# EAGLE design borg16disp (EAGLE 4.16)
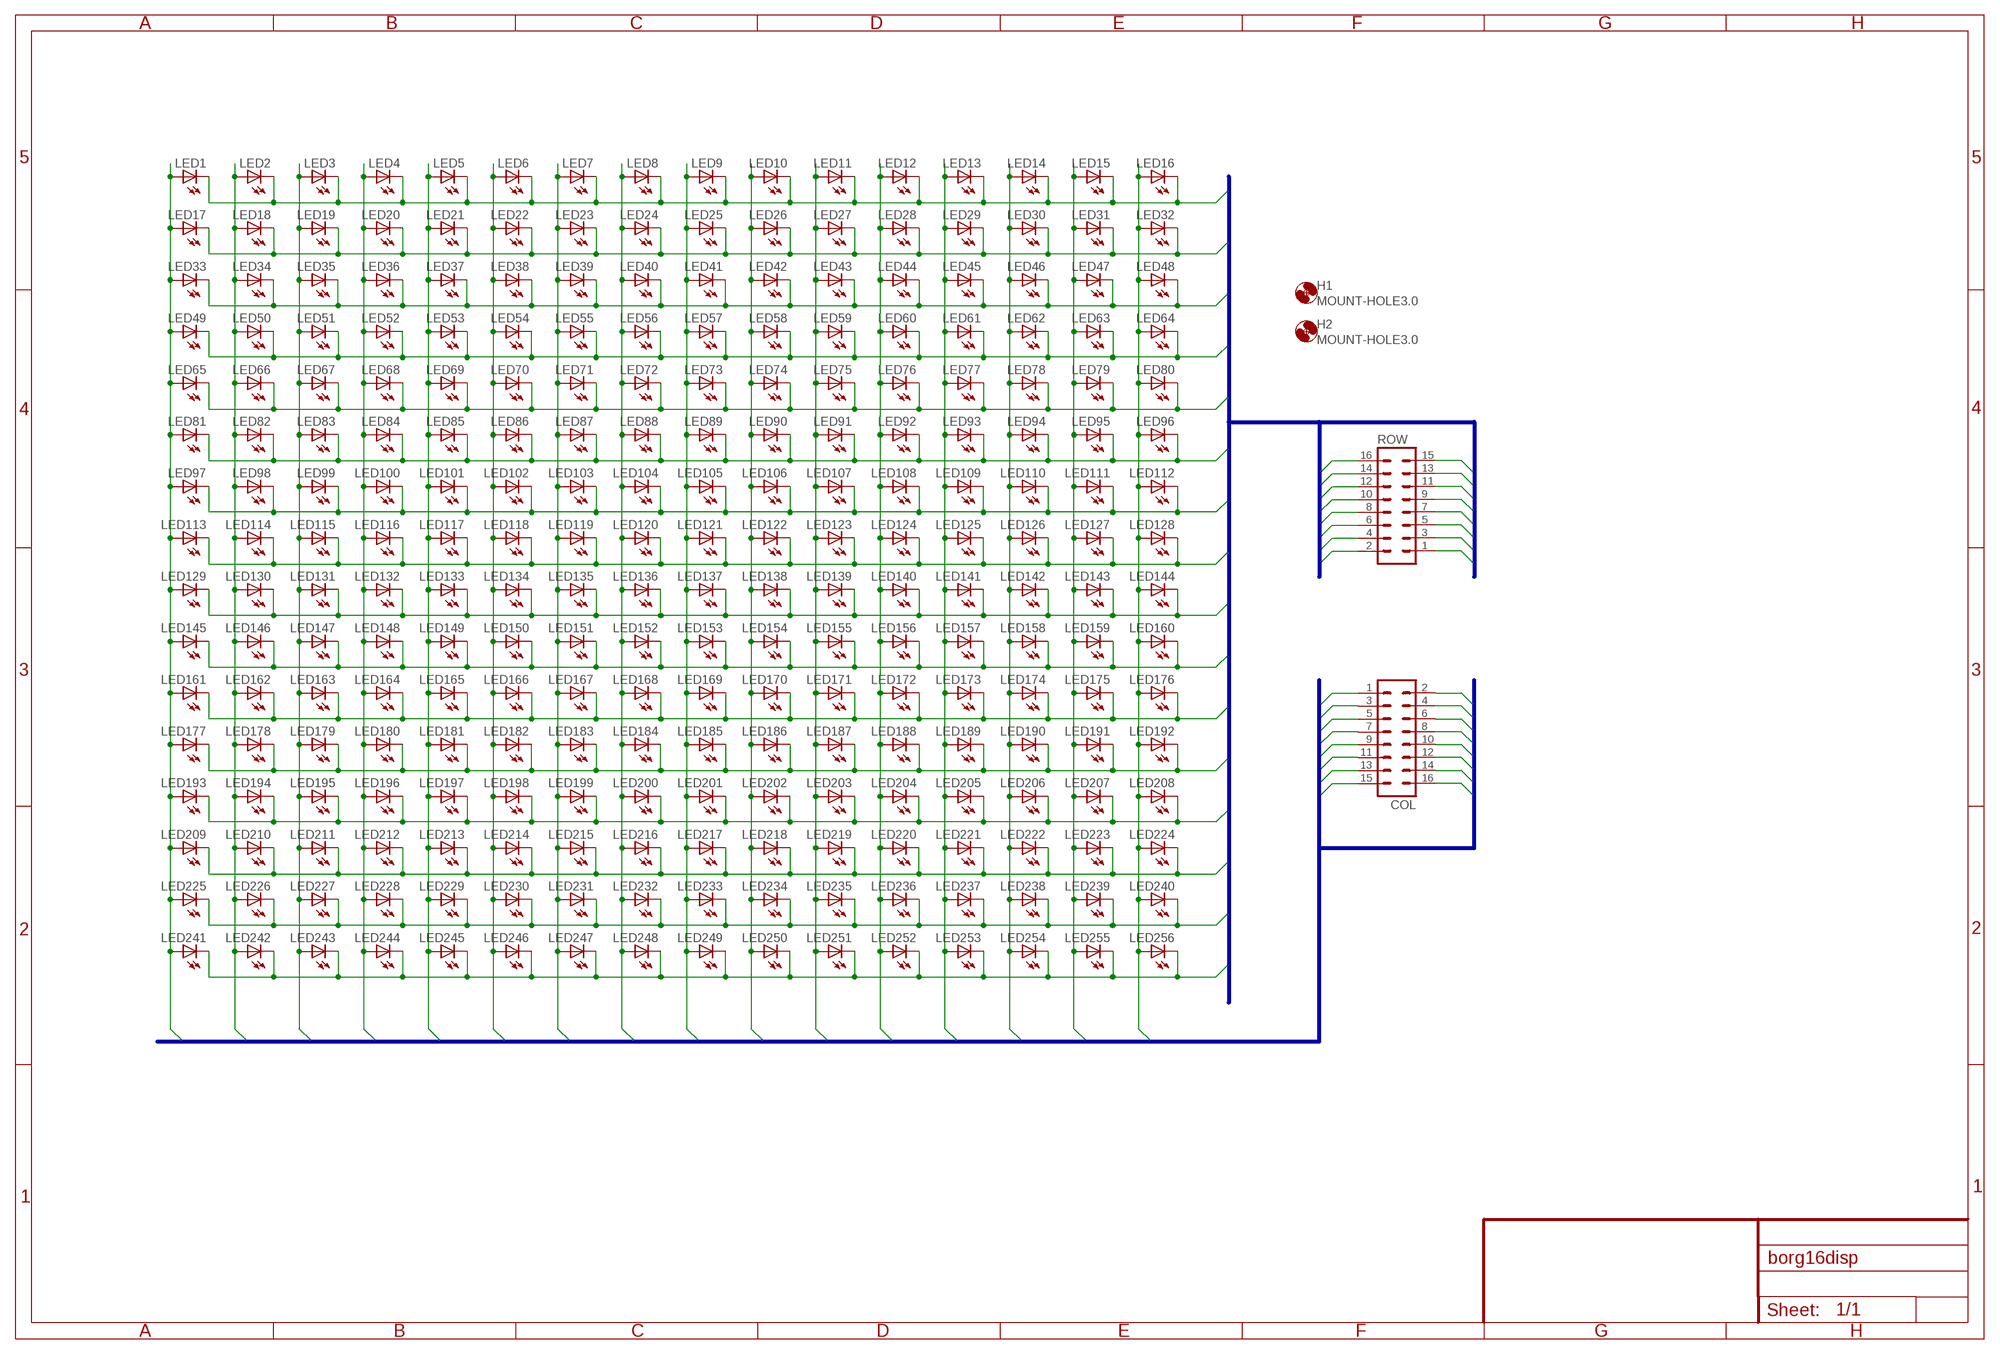
[diagram p0: schematic, sheet 1]

## Parts
COL  ML16  [ML16]
H1  MOUNT-HOLE3.0  [3,0]
H2  MOUNT-HOLE3.0  [3,0]
LED1  LED3MM  [LED3MM]
LED2  LED3MM  [LED3MM]
LED3  LED3MM  [LED3MM]
LED4  LED3MM  [LED3MM]
LED5  LED3MM  [LED3MM]
LED6  LED3MM  [LED3MM]
LED7  LED3MM  [LED3MM]
LED8  LED3MM  [LED3MM]
LED9  LED3MM  [LED3MM]
LED10  LED3MM  [LED3MM]
LED11  LED3MM  [LED3MM]
LED12  LED3MM  [LED3MM]
LED13  LED3MM  [LED3MM]
LED14  LED3MM  [LED3MM]
LED15  LED3MM  [LED3MM]
LED16  LED3MM  [LED3MM]
LED17  LED3MM  [LED3MM]
LED18  LED3MM  [LED3MM]
LED19  LED3MM  [LED3MM]
LED20  LED3MM  [LED3MM]
LED21  LED3MM  [LED3MM]
LED22  LED3MM  [LED3MM]
LED23  LED3MM  [LED3MM]
LED24  LED3MM  [LED3MM]
LED25  LED3MM  [LED3MM]
LED26  LED3MM  [LED3MM]
LED27  LED3MM  [LED3MM]
LED28  LED3MM  [LED3MM]
LED29  LED3MM  [LED3MM]
LED30  LED3MM  [LED3MM]
LED31  LED3MM  [LED3MM]
LED32  LED3MM  [LED3MM]
LED33  LED3MM  [LED3MM]
LED34  LED3MM  [LED3MM]
LED35  LED3MM  [LED3MM]
LED36  LED3MM  [LED3MM]
LED37  LED3MM  [LED3MM]
LED38  LED3MM  [LED3MM]
LED39  LED3MM  [LED3MM]
LED40  LED3MM  [LED3MM]
LED41  LED3MM  [LED3MM]
LED42  LED3MM  [LED3MM]
LED43  LED3MM  [LED3MM]
LED44  LED3MM  [LED3MM]
LED45  LED3MM  [LED3MM]
LED46  LED3MM  [LED3MM]
LED47  LED3MM  [LED3MM]
LED48  LED3MM  [LED3MM]
LED49  LED3MM  [LED3MM]
LED50  LED3MM  [LED3MM]
LED51  LED3MM  [LED3MM]
LED52  LED3MM  [LED3MM]
LED53  LED3MM  [LED3MM]
LED54  LED3MM  [LED3MM]
LED55  LED3MM  [LED3MM]
LED56  LED3MM  [LED3MM]
LED57  LED3MM  [LED3MM]
LED58  LED3MM  [LED3MM]
LED59  LED3MM  [LED3MM]
LED60  LED3MM  [LED3MM]
LED61  LED3MM  [LED3MM]
LED62  LED3MM  [LED3MM]
LED63  LED3MM  [LED3MM]
LED64  LED3MM  [LED3MM]
LED65  LED3MM  [LED3MM]
LED66  LED3MM  [LED3MM]
LED67  LED3MM  [LED3MM]
LED68  LED3MM  [LED3MM]
LED69  LED3MM  [LED3MM]
LED70  LED3MM  [LED3MM]
LED71  LED3MM  [LED3MM]
LED72  LED3MM  [LED3MM]
LED73  LED3MM  [LED3MM]
LED74  LED3MM  [LED3MM]
LED75  LED3MM  [LED3MM]
LED76  LED3MM  [LED3MM]
LED77  LED3MM  [LED3MM]
LED78  LED3MM  [LED3MM]
LED79  LED3MM  [LED3MM]
LED80  LED3MM  [LED3MM]
LED81  LED3MM  [LED3MM]
LED82  LED3MM  [LED3MM]
LED83  LED3MM  [LED3MM]
LED84  LED3MM  [LED3MM]
LED85  LED3MM  [LED3MM]
LED86  LED3MM  [LED3MM]
LED87  LED3MM  [LED3MM]
LED88  LED3MM  [LED3MM]
LED89  LED3MM  [LED3MM]
LED90  LED3MM  [LED3MM]
LED91  LED3MM  [LED3MM]
LED92  LED3MM  [LED3MM]
LED93  LED3MM  [LED3MM]
LED94  LED3MM  [LED3MM]
LED95  LED3MM  [LED3MM]
LED96  LED3MM  [LED3MM]
LED97  LED3MM  [LED3MM]
LED98  LED3MM  [LED3MM]
LED99  LED3MM  [LED3MM]
LED100  LED3MM  [LED3MM]
LED101  LED3MM  [LED3MM]
LED102  LED3MM  [LED3MM]
LED103  LED3MM  [LED3MM]
LED104  LED3MM  [LED3MM]
LED105  LED3MM  [LED3MM]
LED106  LED3MM  [LED3MM]
LED107  LED3MM  [LED3MM]
LED108  LED3MM  [LED3MM]
LED109  LED3MM  [LED3MM]
LED110  LED3MM  [LED3MM]
LED111  LED3MM  [LED3MM]
LED112  LED3MM  [LED3MM]
LED113  LED3MM  [LED3MM]
LED114  LED3MM  [LED3MM]
LED115  LED3MM  [LED3MM]
LED116  LED3MM  [LED3MM]
LED117  LED3MM  [LED3MM]
LED118  LED3MM  [LED3MM]
LED119  LED3MM  [LED3MM]
LED120  LED3MM  [LED3MM]
LED121  LED3MM  [LED3MM]
LED122  LED3MM  [LED3MM]
LED123  LED3MM  [LED3MM]
LED124  LED3MM  [LED3MM]
LED125  LED3MM  [LED3MM]
LED126  LED3MM  [LED3MM]
LED127  LED3MM  [LED3MM]
LED128  LED3MM  [LED3MM]
LED129  LED3MM  [LED3MM]
LED130  LED3MM  [LED3MM]
LED131  LED3MM  [LED3MM]
LED132  LED3MM  [LED3MM]
LED133  LED3MM  [LED3MM]
LED134  LED3MM  [LED3MM]
LED135  LED3MM  [LED3MM]
LED136  LED3MM  [LED3MM]
LED137  LED3MM  [LED3MM]
LED138  LED3MM  [LED3MM]
LED139  LED3MM  [LED3MM]
LED140  LED3MM  [LED3MM]
LED141  LED3MM  [LED3MM]
LED142  LED3MM  [LED3MM]
LED143  LED3MM  [LED3MM]
LED144  LED3MM  [LED3MM]
LED145  LED3MM  [LED3MM]
LED146  LED3MM  [LED3MM]
LED147  LED3MM  [LED3MM]
LED148  LED3MM  [LED3MM]
LED149  LED3MM  [LED3MM]
LED150  LED3MM  [LED3MM]
LED151  LED3MM  [LED3MM]
LED152  LED3MM  [LED3MM]
LED153  LED3MM  [LED3MM]
LED154  LED3MM  [LED3MM]
LED155  LED3MM  [LED3MM]
LED156  LED3MM  [LED3MM]
LED157  LED3MM  [LED3MM]
LED158  LED3MM  [LED3MM]
LED159  LED3MM  [LED3MM]
LED160  LED3MM  [LED3MM]
LED161  LED3MM  [LED3MM]
LED162  LED3MM  [LED3MM]
LED163  LED3MM  [LED3MM]
LED164  LED3MM  [LED3MM]
LED165  LED3MM  [LED3MM]
LED166  LED3MM  [LED3MM]
LED167  LED3MM  [LED3MM]
LED168  LED3MM  [LED3MM]
LED169  LED3MM  [LED3MM]
LED170  LED3MM  [LED3MM]
LED171  LED3MM  [LED3MM]
LED172  LED3MM  [LED3MM]
LED173  LED3MM  [LED3MM]
LED174  LED3MM  [LED3MM]
LED175  LED3MM  [LED3MM]
LED176  LED3MM  [LED3MM]
LED177  LED3MM  [LED3MM]
LED178  LED3MM  [LED3MM]
LED179  LED3MM  [LED3MM]
LED180  LED3MM  [LED3MM]
LED181  LED3MM  [LED3MM]
LED182  LED3MM  [LED3MM]
LED183  LED3MM  [LED3MM]
LED184  LED3MM  [LED3MM]
LED185  LED3MM  [LED3MM]
LED186  LED3MM  [LED3MM]
LED187  LED3MM  [LED3MM]
LED188  LED3MM  [LED3MM]
LED189  LED3MM  [LED3MM]
LED190  LED3MM  [LED3MM]
LED191  LED3MM  [LED3MM]
LED192  LED3MM  [LED3MM]
LED193  LED3MM  [LED3MM]
LED194  LED3MM  [LED3MM]
LED195  LED3MM  [LED3MM]
LED196  LED3MM  [LED3MM]
LED197  LED3MM  [LED3MM]
LED198  LED3MM  [LED3MM]
LED199  LED3MM  [LED3MM]
LED200  LED3MM  [LED3MM]
LED201  LED3MM  [LED3MM]
LED202  LED3MM  [LED3MM]
LED203  LED3MM  [LED3MM]
LED204  LED3MM  [LED3MM]
LED205  LED3MM  [LED3MM]
LED206  LED3MM  [LED3MM]
LED207  LED3MM  [LED3MM]
LED208  LED3MM  [LED3MM]
LED209  LED3MM  [LED3MM]
LED210  LED3MM  [LED3MM]
LED211  LED3MM  [LED3MM]
LED212  LED3MM  [LED3MM]
LED213  LED3MM  [LED3MM]
LED214  LED3MM  [LED3MM]
LED215  LED3MM  [LED3MM]
LED216  LED3MM  [LED3MM]
LED217  LED3MM  [LED3MM]
LED218  LED3MM  [LED3MM]
LED219  LED3MM  [LED3MM]
LED220  LED3MM  [LED3MM]
LED221  LED3MM  [LED3MM]
LED222  LED3MM  [LED3MM]
LED223  LED3MM  [LED3MM]
LED224  LED3MM  [LED3MM]
LED225  LED3MM  [LED3MM]
LED226  LED3MM  [LED3MM]
LED227  LED3MM  [LED3MM]
LED228  LED3MM  [LED3MM]
LED229  LED3MM  [LED3MM]
LED230  LED3MM  [LED3MM]
LED231  LED3MM  [LED3MM]
LED232  LED3MM  [LED3MM]
LED233  LED3MM  [LED3MM]
LED234  LED3MM  [LED3MM]
LED235  LED3MM  [LED3MM]
LED236  LED3MM  [LED3MM]
LED237  LED3MM  [LED3MM]
LED238  LED3MM  [LED3MM]
LED239  LED3MM  [LED3MM]
LED240  LED3MM  [LED3MM]
LED241  LED3MM  [LED3MM]
LED242  LED3MM  [LED3MM]
LED243  LED3MM  [LED3MM]
LED244  LED3MM  [LED3MM]
LED245  LED3MM  [LED3MM]
LED246  LED3MM  [LED3MM]
LED247  LED3MM  [LED3MM]
LED248  LED3MM  [LED3MM]
LED249  LED3MM  [LED3MM]
LED250  LED3MM  [LED3MM]
LED251  LED3MM  [LED3MM]
LED252  LED3MM  [LED3MM]
LED253  LED3MM  [LED3MM]
LED254  LED3MM  [LED3MM]
LED255  LED3MM  [LED3MM]
LED256  LED3MM  [LED3MM]
ROW  ML16  [ML16]

## Nets
COL1: COL.16 LED1.A LED17.A LED33.A LED49.A LED65.A LED81.A LED97.A LED113.A LED129.A LED145.A LED161.A LED177.A LED193.A LED209.A LED225.A LED241.A
COL2: COL.15 LED2.A LED18.A LED34.A LED50.A LED66.A LED82.A LED98.A LED114.A LED130.A LED146.A LED162.A LED178.A LED194.A LED210.A LED226.A LED242.A
COL3: COL.14 LED3.A LED19.A LED35.A LED51.A LED67.A LED83.A LED99.A LED115.A LED131.A LED147.A LED163.A LED179.A LED195.A LED211.A LED227.A LED243.A
COL4: COL.13 LED4.A LED20.A LED36.A LED52.A LED68.A LED84.A LED100.A LED116.A LED132.A LED148.A LED164.A LED180.A LED196.A LED212.A LED228.A LED244.A
COL5: COL.12 LED5.A LED21.A LED37.A LED53.A LED69.A LED85.A LED101.A LED117.A LED133.A LED149.A LED165.A LED181.A LED197.A LED213.A LED229.A LED245.A
COL6: COL.11 LED6.A LED22.A LED38.A LED54.A LED70.A LED86.A LED102.A LED118.A LED134.A LED150.A LED166.A LED182.A LED198.A LED214.A LED230.A LED246.A
COL7: COL.10 LED7.A LED23.A LED39.A LED55.A LED71.A LED87.A LED103.A LED119.A LED135.A LED151.A LED167.A LED183.A LED199.A LED215.A LED231.A LED247.A
COL8: COL.9 LED8.A LED24.A LED40.A LED56.A LED72.A LED88.A LED104.A LED120.A LED136.A LED152.A LED168.A LED184.A LED200.A LED216.A LED232.A LED248.A
COL9: COL.8 LED9.A LED25.A LED41.A LED57.A LED73.A LED89.A LED105.A LED121.A LED137.A LED153.A LED169.A LED185.A LED201.A LED217.A LED233.A LED249.A
COL10: COL.7 LED10.A LED26.A LED42.A LED58.A LED74.A LED90.A LED106.A LED122.A LED138.A LED154.A LED170.A LED186.A LED202.A LED218.A LED234.A LED250.A
COL11: COL.6 LED11.A LED27.A LED43.A LED59.A LED75.A LED91.A LED107.A LED123.A LED139.A LED155.A LED171.A LED187.A LED203.A LED219.A LED235.A LED251.A
COL12: COL.5 LED12.A LED28.A LED44.A LED60.A LED76.A LED92.A LED108.A LED124.A LED140.A LED156.A LED172.A LED188.A LED204.A LED220.A LED236.A LED252.A
COL13: COL.4 LED13.A LED29.A LED45.A LED61.A LED77.A LED93.A LED109.A LED125.A LED141.A LED157.A LED173.A LED189.A LED205.A LED221.A LED237.A LED253.A
COL14: COL.3 LED14.A LED30.A LED46.A LED62.A LED78.A LED94.A LED110.A LED126.A LED142.A LED158.A LED174.A LED190.A LED206.A LED222.A LED238.A LED254.A
COL15: COL.2 LED15.A LED31.A LED47.A LED63.A LED79.A LED95.A LED111.A LED127.A LED143.A LED159.A LED175.A LED191.A LED207.A LED223.A LED239.A LED255.A
COL16: COL.1 LED16.A LED32.A LED48.A LED64.A LED80.A LED96.A LED112.A LED128.A LED144.A LED160.A LED176.A LED192.A LED208.A LED224.A LED240.A LED256.A
ROW1: LED1.K(C) LED2.K(C) LED3.K(C) LED4.K(C) LED5.K(C) LED6.K(C) LED7.K(C) LED8.K(C) LED9.K(C) LED10.K(C) LED11.K(C) LED12.K(C) LED13.K(C) LED14.K(C) LED15.K(C) LED16.K(C) ROW.1
ROW2: LED17.K(C) LED18.K(C) LED19.K(C) LED20.K(C) LED21.K(C) LED22.K(C) LED23.K(C) LED24.K(C) LED25.K(C) LED26.K(C) LED27.K(C) LED28.K(C) LED29.K(C) LED30.K(C) LED31.K(C) LED32.K(C) ROW.2
ROW3: LED33.K(C) LED34.K(C) LED35.K(C) LED36.K(C) LED37.K(C) LED38.K(C) LED39.K(C) LED40.K(C) LED41.K(C) LED42.K(C) LED43.K(C) LED44.K(C) LED45.K(C) LED46.K(C) LED47.K(C) LED48.K(C) ROW.3
ROW4: LED49.K(C) LED50.K(C) LED51.K(C) LED52.K(C) LED53.K(C) LED54.K(C) LED55.K(C) LED56.K(C) LED57.K(C) LED58.K(C) LED59.K(C) LED60.K(C) LED61.K(C) LED62.K(C) LED63.K(C) LED64.K(C) ROW.4
ROW5: LED65.K(C) LED66.K(C) LED67.K(C) LED68.K(C) LED69.K(C) LED70.K(C) LED71.K(C) LED72.K(C) LED73.K(C) LED74.K(C) LED75.K(C) LED76.K(C) LED77.K(C) LED78.K(C) LED79.K(C) LED80.K(C) ROW.5
ROW6: LED81.K(C) LED82.K(C) LED83.K(C) LED84.K(C) LED85.K(C) LED86.K(C) LED87.K(C) LED88.K(C) LED89.K(C) LED90.K(C) LED91.K(C) LED92.K(C) LED93.K(C) LED94.K(C) LED95.K(C) LED96.K(C) ROW.6
ROW7: LED97.K(C) LED98.K(C) LED99.K(C) LED100.K(C) LED101.K(C) LED102.K(C) LED103.K(C) LED104.K(C) LED105.K(C) LED106.K(C) LED107.K(C) LED108.K(C) LED109.K(C) LED110.K(C) LED111.K(C) LED112.K(C) ROW.7
ROW8: LED113.K(C) LED114.K(C) LED115.K(C) LED116.K(C) LED117.K(C) LED118.K(C) LED119.K(C) LED120.K(C) LED121.K(C) LED122.K(C) LED123.K(C) LED124.K(C) LED125.K(C) LED126.K(C) LED127.K(C) LED128.K(C) ROW.8
ROW9: LED129.K(C) LED130.K(C) LED131.K(C) LED132.K(C) LED133.K(C) LED134.K(C) LED135.K(C) LED136.K(C) LED137.K(C) LED138.K(C) LED139.K(C) LED140.K(C) LED141.K(C) LED142.K(C) LED143.K(C) LED144.K(C) ROW.9
ROW10: LED145.K(C) LED146.K(C) LED147.K(C) LED148.K(C) LED149.K(C) LED150.K(C) LED151.K(C) LED152.K(C) LED153.K(C) LED154.K(C) LED155.K(C) LED156.K(C) LED157.K(C) LED158.K(C) LED159.K(C) LED160.K(C) ROW.10
ROW11: LED161.K(C) LED162.K(C) LED163.K(C) LED164.K(C) LED165.K(C) LED166.K(C) LED167.K(C) LED168.K(C) LED169.K(C) LED170.K(C) LED171.K(C) LED172.K(C) LED173.K(C) LED174.K(C) LED175.K(C) LED176.K(C) ROW.11
ROW12: LED177.K(C) LED178.K(C) LED179.K(C) LED180.K(C) LED181.K(C) LED182.K(C) LED183.K(C) LED184.K(C) LED185.K(C) LED186.K(C) LED187.K(C) LED188.K(C) LED189.K(C) LED190.K(C) LED191.K(C) LED192.K(C) ROW.12
ROW13: LED193.K(C) LED194.K(C) LED195.K(C) LED196.K(C) LED197.K(C) LED198.K(C) LED199.K(C) LED200.K(C) LED201.K(C) LED202.K(C) LED203.K(C) LED204.K(C) LED205.K(C) LED206.K(C) LED207.K(C) LED208.K(C) ROW.13
ROW14: LED209.K(C) LED210.K(C) LED211.K(C) LED212.K(C) LED213.K(C) LED214.K(C) LED215.K(C) LED216.K(C) LED217.K(C) LED218.K(C) LED219.K(C) LED220.K(C) LED221.K(C) LED222.K(C) LED223.K(C) LED224.K(C) ROW.14
ROW15: LED225.K(C) LED226.K(C) LED227.K(C) LED228.K(C) LED229.K(C) LED230.K(C) LED231.K(C) LED232.K(C) LED233.K(C) LED234.K(C) LED235.K(C) LED236.K(C) LED237.K(C) LED238.K(C) LED239.K(C) LED240.K(C) ROW.15
ROW16: LED241.K(C) LED242.K(C) LED243.K(C) LED244.K(C) LED245.K(C) LED246.K(C) LED247.K(C) LED248.K(C) LED249.K(C) LED250.K(C) LED251.K(C) LED252.K(C) LED253.K(C) LED254.K(C) LED255.K(C) LED256.K(C) ROW.16

## Buses
COLUMS:COL1,COL2,COL3,COL4,COL5,COL6,COL7,COL8,COL9,COL10,COL11,COL12,COL13,COL14,COL15,COL16
ROWS:ROW1,ROW2,ROW3,ROW4,ROW5,ROW6,ROW7,ROW8,ROW9,ROW10,ROW11,ROW12,ROW13,ROW14,ROW15,ROW16

## Library data of the parts
COL ROW = con-harting-ml:ML16: HARTING
H1 H2 = holes:MOUNT-HOLE: MOUNTING HOLE with drill center marker
LED1-LED256 = led:LED: LED OSRAM: - CHIPLED LG R971, LG N971, LY N971, LG Q971, LY Q971, LO R971, LY R971 LH N974, LH R974 LS Q976, LO Q976, LY Q976 LO Q996 - Hyper CHIPLED LW Q18S LB Q993, LB Q99A, LB R99A - SideLED LS A670, LO A670, LY A670, LG A670, LP A670 LB A673, LV A673, LT A673, LW A673 LH A674 LY A675 LS A676, LA A676, LO A676, LY A676, LW A676 LS A679, LY A679, LG A679 - Hyper Micro SIDELED® LS Y876, LA Y876, LO Y876, LY Y876 LT Y87S - SmartLED LW L88C, LW L88S LB L89C, LB L89S, LG L890 LS L89K, LO L89K, LY L89K LS L896, LA L896, LO L896, LY L896 - TOPLED LS T670, LO T670, LY T670, LG T670, LP T670 LSG T670, LSP T670, LSY T670, LOP T670, LYG T670 LG T671, LOG T671, LSG T671 LB T673, LV T673, LT T673, LW T673 LH T674 LS T676, LA T676, LO T676, LY T676, LB T676, LH T676, LSB T676, LW T676 LB T67C, LV T67C, LT T67C, LS T67K, LO T67K, LY T67K, LW E67C LS E67B, LA E67B, LO E67B, LY E67B, LB E67C, LV E67C, LT E67C LW T67C LS T679, LY T679, LG T679 LS T770, LO T770, LY T770, LG T770, LP T770 LB T773, LV T773, LT T773, LW T773 LH T774 LS E675, LA E675, LY E675, LS T675 LS T776, LA T776, LO T776, LY T776, LB T776 LHGB T686 LT T68C, LB T68C - Hyper Mini TOPLED® LB M676 - Mini TOPLED Santana® LG M470 LS M47K, LO M47K, LY M47K Source: http://www.osram.convergy.de/

## Board
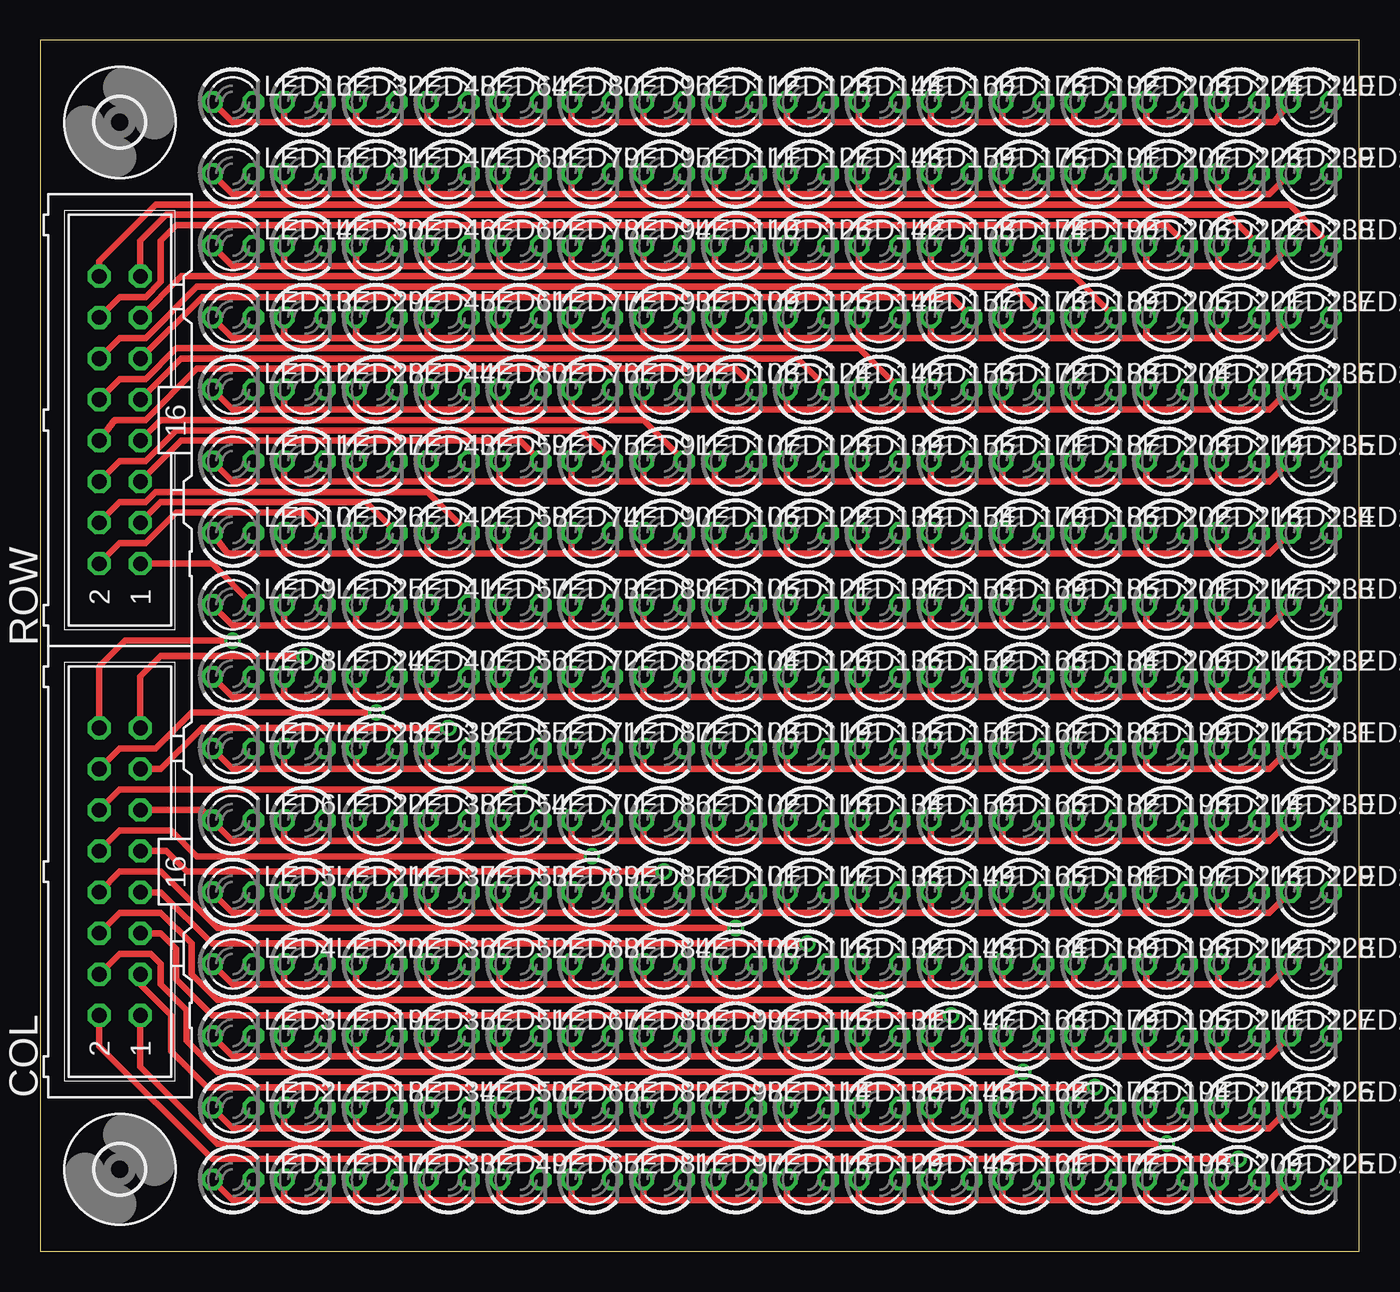
[diagram p1: board, top side]
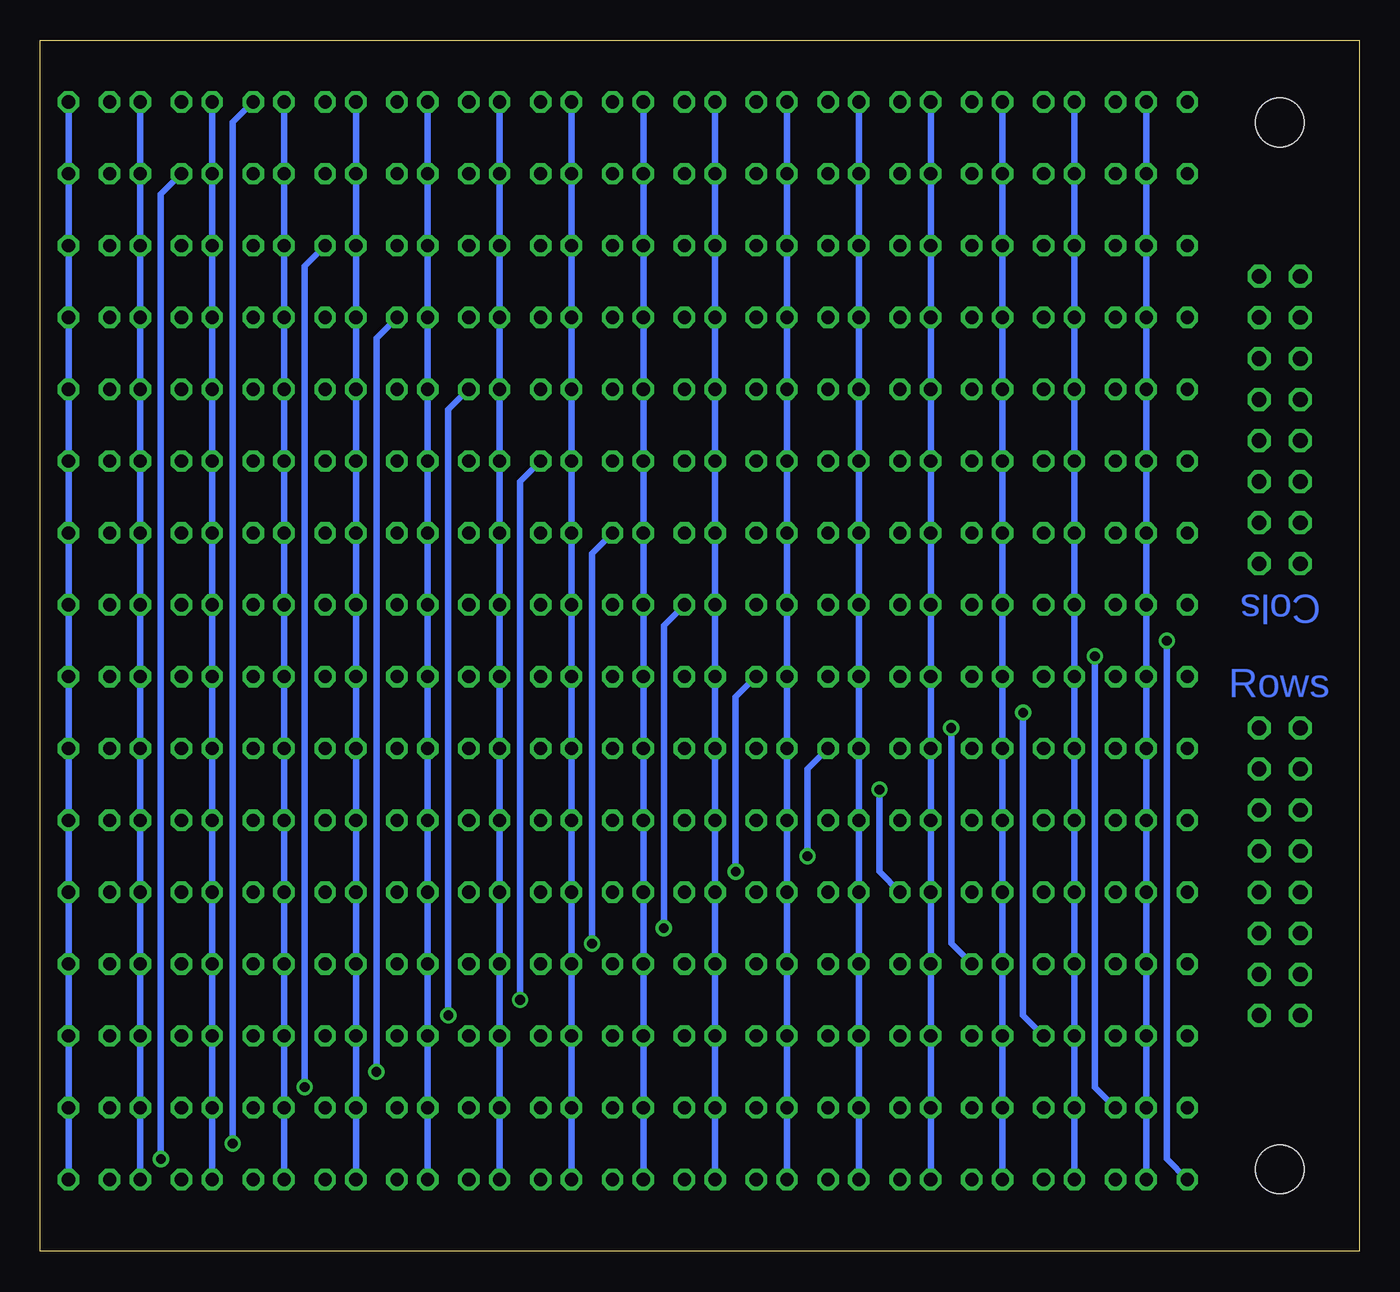
[diagram p2: board, bottom side, seen from below]

Size 81.58 x 74.92 mm. Coordinates in mm from the lower left corner, seen from the top.
Outline: 0,0 81.58,0 81.58,74.92 0,74.92 0,0
Copper layers (1*16): Top 0.035mm / dielectric 1.5mm / Bottom 0.035mm
Design rules "default": minimum track width 10mil, minimum drill 12mil, track to track 8mil, track to pad 8mil, pad to pad 8mil, via to via 8mil, smd to smd 8mil, copper to edge 40mil, drill to drill 8mil, minimum pad ring 10mil, minimum via ring 8mil, stop-mask expansion 4mil, vias tented up to drill 0mil, thermal gap 10mil

### Footprints (pad centres in the part's own frame; a part is rotated, then mirrored left to right if it is on the bottom)
ML16 = drill 0.914 octagon: 1 -8.89,-1.27; 2 -8.89,1.27; 3 -6.35,-1.27; 4 -6.35,1.27; 5 -3.81,-1.27; 6 -3.81,1.27; 7 -1.27,-1.27; 8 -1.27,1.27; 9 1.27,-1.27; 10 1.27,1.27; 11 3.81,-1.27; 12 3.81,1.27; 13 6.35,-1.27; 14 6.35,1.27; 15 8.89,-1.27; 16 8.89,1.27
3,0 = hole 3: 0,0
LED3MM = drill 0.813 octagon: A -1.27,0; K 1.27,0

### Placement (x,y rotation side)
COL  4.92,23.49 90 top
H1  4.92,69.84 0 top
H2  4.92,5.08 0 top
LED1  11.9,4.44 0 top
LED2  11.9,8.88 0 top
LED3  11.9,13.33 0 top
LED4  11.9,17.78 0 top
LED5  11.9,22.22 0 top
LED6  11.9,26.66 0 top
LED7  11.9,31.11 0 top
LED8  11.9,35.55 0 top
LED9  11.9,40 0 top
LED10  11.9,44.45 0 top
LED11  11.9,48.89 0 top
LED12  11.9,53.34 0 top
LED13  11.9,57.78 0 top
LED14  11.9,62.23 0 top
LED15  11.9,66.67 0 top
LED16  11.9,71.11 0 top
LED17  16.34,4.44 0 top
LED18  16.34,8.88 0 top
LED19  16.34,13.33 0 top
LED20  16.34,17.78 0 top
LED21  16.34,22.22 0 top
LED22  16.34,26.66 0 top
LED23  16.34,31.11 0 top
LED24  16.34,35.55 0 top
LED25  16.34,40 0 top
LED26  16.34,44.45 0 top
LED27  16.34,48.89 0 top
LED28  16.34,53.34 0 top
LED29  16.34,57.78 0 top
LED30  16.34,62.23 0 top
LED31  16.34,66.67 0 top
LED32  16.34,71.11 0 top
LED33  20.79,4.44 0 top
LED34  20.79,8.88 0 top
LED35  20.79,13.33 0 top
LED36  20.79,17.78 0 top
LED37  20.79,22.22 0 top
LED38  20.79,26.66 0 top
LED39  20.79,31.11 0 top
LED40  20.79,35.55 0 top
LED41  20.79,40 0 top
LED42  20.79,44.45 0 top
LED43  20.79,48.89 0 top
LED44  20.79,53.34 0 top
LED45  20.79,57.78 0 top
LED46  20.79,62.23 0 top
LED47  20.79,66.67 0 top
LED48  20.79,71.11 0 top
LED49  25.23,4.44 0 top
LED50  25.23,8.88 0 top
LED51  25.23,13.33 0 top
LED52  25.23,17.78 0 top
LED53  25.23,22.22 0 top
LED54  25.23,26.66 0 top
LED55  25.23,31.11 0 top
LED56  25.23,35.55 0 top
LED57  25.23,40 0 top
LED58  25.23,44.45 0 top
LED59  25.23,48.89 0 top
LED60  25.23,53.34 0 top
LED61  25.23,57.78 0 top
LED62  25.23,62.23 0 top
LED63  25.23,66.67 0 top
LED64  25.23,71.11 0 top
LED65  29.68,4.44 0 top
LED66  29.68,8.88 0 top
LED67  29.68,13.33 0 top
LED68  29.68,17.78 0 top
LED69  29.68,22.22 0 top
LED70  29.68,26.66 0 top
LED71  29.68,31.11 0 top
LED72  29.68,35.55 0 top
LED73  29.68,40 0 top
LED74  29.68,44.45 0 top
LED75  29.68,48.89 0 top
LED76  29.68,53.34 0 top
LED77  29.68,57.78 0 top
LED78  29.68,62.23 0 top
LED79  29.68,66.67 0 top
LED80  29.68,71.11 0 top
LED81  34.12,4.44 0 top
LED82  34.12,8.88 0 top
LED83  34.12,13.33 0 top
LED84  34.12,17.78 0 top
LED85  34.12,22.22 0 top
LED86  34.12,26.66 0 top
LED87  34.12,31.11 0 top
LED88  34.12,35.55 0 top
LED89  34.12,40 0 top
LED90  34.12,44.45 0 top
LED91  34.12,48.89 0 top
LED92  34.12,53.34 0 top
LED93  34.12,57.78 0 top
LED94  34.12,62.23 0 top
LED95  34.12,66.67 0 top
LED96  34.12,71.11 0 top
LED97  38.57,4.44 0 top
LED98  38.57,8.88 0 top
LED99  38.57,13.33 0 top
LED100  38.57,17.78 0 top
LED101  38.57,22.22 0 top
LED102  38.57,26.66 0 top
LED103  38.57,31.11 0 top
LED104  38.57,35.55 0 top
LED105  38.57,40 0 top
LED106  38.57,44.45 0 top
LED107  38.57,48.89 0 top
LED108  38.57,53.34 0 top
LED109  38.57,57.78 0 top
LED110  38.57,62.23 0 top
LED111  38.57,66.67 0 top
LED112  38.57,71.11 0 top
LED113  43.02,4.44 0 top
LED114  43.02,8.88 0 top
LED115  43.02,13.33 0 top
LED116  43.02,17.78 0 top
LED117  43.02,22.22 0 top
LED118  43.02,26.66 0 top
LED119  43.02,31.11 0 top
LED120  43.02,35.55 0 top
LED121  43.02,40 0 top
LED122  43.02,44.45 0 top
LED123  43.02,48.89 0 top
LED124  43.02,53.34 0 top
LED125  43.02,57.78 0 top
LED126  43.02,62.23 0 top
LED127  43.02,66.67 0 top
LED128  43.02,71.11 0 top
LED129  47.46,4.44 0 top
LED130  47.46,8.88 0 top
LED131  47.46,13.33 0 top
LED132  47.46,17.78 0 top
LED133  47.46,22.22 0 top
LED134  47.46,26.66 0 top
LED135  47.46,31.11 0 top
LED136  47.46,35.55 0 top
LED137  47.46,40 0 top
LED138  47.46,44.45 0 top
LED139  47.46,48.89 0 top
LED140  47.46,53.34 0 top
LED141  47.46,57.78 0 top
LED142  47.46,62.23 0 top
LED143  47.46,66.67 0 top
LED144  47.46,71.11 0 top
LED145  51.91,4.44 0 top
LED146  51.91,8.88 0 top
LED147  51.91,13.33 0 top
LED148  51.91,17.78 0 top
LED149  51.91,22.22 0 top
LED150  51.91,26.66 0 top
LED151  51.91,31.11 0 top
LED152  51.91,35.55 0 top
LED153  51.91,40 0 top
LED154  51.91,44.45 0 top
LED155  51.91,48.89 0 top
LED156  51.91,53.34 0 top
LED157  51.91,57.78 0 top
LED158  51.91,62.23 0 top
LED159  51.91,66.67 0 top
LED160  51.91,71.11 0 top
LED161  56.35,4.44 0 top
LED162  56.35,8.88 0 top
LED163  56.35,13.33 0 top
LED164  56.35,17.78 0 top
LED165  56.35,22.22 0 top
LED166  56.35,26.66 0 top
LED167  56.35,31.11 0 top
LED168  56.35,35.55 0 top
LED169  56.35,40 0 top
LED170  56.35,44.45 0 top
LED171  56.35,48.89 0 top
LED172  56.35,53.34 0 top
LED173  56.35,57.78 0 top
LED174  56.35,62.23 0 top
LED175  56.35,66.67 0 top
LED176  56.35,71.11 0 top
LED177  60.8,4.44 0 top
LED178  60.8,8.88 0 top
LED179  60.8,13.33 0 top
LED180  60.8,17.78 0 top
LED181  60.8,22.22 0 top
LED182  60.8,26.66 0 top
LED183  60.8,31.11 0 top
LED184  60.8,35.55 0 top
LED185  60.8,40 0 top
LED186  60.8,44.45 0 top
LED187  60.8,48.89 0 top
LED188  60.8,53.34 0 top
LED189  60.8,57.78 0 top
LED190  60.8,62.23 0 top
LED191  60.8,66.67 0 top
LED192  60.8,71.11 0 top
LED193  65.24,4.44 0 top
LED194  65.24,8.88 0 top
LED195  65.24,13.33 0 top
LED196  65.24,17.78 0 top
LED197  65.24,22.22 0 top
LED198  65.24,26.66 0 top
LED199  65.24,31.11 0 top
LED200  65.24,35.55 0 top
LED201  65.24,40 0 top
LED202  65.24,44.45 0 top
LED203  65.24,48.89 0 top
LED204  65.24,53.34 0 top
LED205  65.24,57.78 0 top
LED206  65.24,62.23 0 top
LED207  65.24,66.67 0 top
LED208  65.24,71.11 0 top
LED209  69.69,4.44 0 top
LED210  69.69,8.88 0 top
LED211  69.69,13.33 0 top
LED212  69.69,17.78 0 top
LED213  69.69,22.22 0 top
LED214  69.69,26.66 0 top
LED215  69.69,31.11 0 top
LED216  69.69,35.55 0 top
LED217  69.69,40 0 top
LED218  69.69,44.45 0 top
LED219  69.69,48.89 0 top
LED220  69.69,53.34 0 top
LED221  69.69,57.78 0 top
LED222  69.69,62.23 0 top
LED223  69.69,66.67 0 top
LED224  69.69,71.11 0 top
LED225  74.13,4.44 0 top
LED226  74.13,8.88 0 top
LED227  74.13,13.33 0 top
LED228  74.13,17.78 0 top
LED229  74.13,22.22 0 top
LED230  74.13,26.66 0 top
LED231  74.13,31.11 0 top
LED232  74.13,35.55 0 top
LED233  74.13,40 0 top
LED234  74.13,44.45 0 top
LED235  74.13,48.89 0 top
LED236  74.13,53.34 0 top
LED237  74.13,57.78 0 top
LED238  74.13,62.23 0 top
LED239  74.13,66.67 0 top
LED240  74.13,71.11 0 top
LED241  78.58,4.44 0 top
LED242  78.58,8.88 0 top
LED243  78.58,13.33 0 top
LED244  78.58,17.78 0 top
LED245  78.58,22.22 0 top
LED246  78.58,26.66 0 top
LED247  78.58,31.11 0 top
LED248  78.58,35.55 0 top
LED249  78.58,40 0 top
LED250  78.58,44.45 0 top
LED251  78.58,48.89 0 top
LED252  78.58,53.34 0 top
LED253  78.58,57.78 0 top
LED254  78.58,62.23 0 top
LED255  78.58,66.67 0 top
LED256  78.58,71.11 0 top
ROW  4.92,51.43 90 top

### Tracks (layer width: path | path; a pad name or v marks a point on that pad's centre or on a via)
COL1  (via drill 0.6)
  Top 0.406: LED241.A 76.03,3.17 72.86,3.17 | 15.08,3.17 11.9,3.17 LED1.A | 15.08,3.17 19.52,3.17 | 19.52,3.17 23.96,3.17 | 23.96,3.17 28.41,3.17 | 28.41,3.17 32.85,3.17 | 32.85,3.17 37.3,3.17 | 37.3,3.17 41.74,3.17 | 41.74,3.17 46.19,3.17 | 46.19,3.17 50.63,3.17 | 50.63,3.17 55.08,3.17 | 55.08,3.17 59.52,3.17 | 59.52,3.17 63.97,3.17 | 63.97,3.17 68.41,3.17 | 68.41,3.17 72.86,3.17 | 72.86,3.17 LED225.A | 68.41,3.17 LED209.A | 63.97,3.17 LED193.A | 59.52,3.17 LED177.A | 55.08,3.17 LED161.A | 50.63,3.17 LED145.A | 46.19,3.17 LED129.A | 41.74,3.17 LED113.A | 37.3,3.17 LED97.A | 32.85,3.17 LED81.A | 28.41,3.17 LED65.A | 23.96,3.17 LED49.A | 19.52,3.17 LED33.A | 15.08,3.17 LED17.A | v11.9,37.78 5.23,37.78 3.64,36.19 COL.16
  Bottom 0.406: LED1.A 11.9,5.71 v11.9,37.78
COL2  (via drill 0.6)
  Top 0.406: LED2.A 11.9,7.61 15.08,7.61 | 15.08,7.61 19.52,7.61 | 19.52,7.61 23.96,7.61 | 23.96,7.61 28.41,7.61 | 28.41,7.61 32.85,7.61 | 32.85,7.61 37.3,7.61 | 37.3,7.61 41.74,7.61 | 41.74,7.61 46.19,7.61 | 46.19,7.61 50.63,7.61 | 50.63,7.61 55.08,7.61 | 55.08,7.61 59.52,7.61 | 59.52,7.61 63.97,7.61 | 63.97,7.61 68.41,7.61 | 68.41,7.61 72.86,7.61 | 72.86,7.61 76.03,7.61 LED242.A | 72.86,7.61 LED226.A | 68.41,7.61 LED210.A | 63.97,7.61 LED194.A | 59.52,7.61 LED178.A | 55.08,7.61 LED162.A | 50.63,7.61 LED146.A | 46.19,7.61 LED130.A | 41.74,7.61 LED114.A | 37.3,7.61 LED98.A | 32.85,7.61 LED82.A | 28.41,7.61 LED66.A | 23.96,7.61 LED50.A | 19.52,7.61 LED34.A | 15.08,7.61 LED18.A | v16.34,36.83 7.46,36.83 6.18,35.55 COL.15
  Bottom 0.406: v16.34,36.83 16.34,10.16 LED18.A
COL3  (via drill 0.6)
  Top 0.406: LED3.A 11.9,12.06 15.08,12.06 | 15.08,12.06 19.52,12.06 | 19.52,12.06 23.96,12.06 | 23.96,12.06 28.41,12.06 | 28.41,12.06 32.85,12.06 | 32.85,12.06 37.3,12.06 | 37.3,12.06 41.74,12.06 | 41.74,12.06 46.19,12.06 | 46.19,12.06 50.63,12.06 | 50.63,12.06 55.08,12.06 | 55.08,12.06 59.52,12.06 | 59.52,12.06 63.97,12.06 | 63.97,12.06 68.41,12.06 | 68.41,12.06 72.86,12.06 | 72.86,12.06 76.03,12.06 LED243.A | 72.86,12.06 LED227.A | 68.41,12.06 LED211.A | 63.97,12.06 LED195.A | 59.52,12.06 LED179.A | 55.08,12.06 LED163.A | 50.63,12.06 LED147.A | 46.19,12.06 LED131.A | 41.74,12.06 LED115.A | 37.3,12.06 LED99.A | 32.85,12.06 LED83.A | 28.41,12.06 LED67.A | 23.96,12.06 LED51.A | 19.52,12.06 LED35.A | 15.08,12.06 LED19.A | COL.14 4.92,31.11 7.14,31.11 9.36,33.33 v20.79,33.33
  Bottom 0.406: v20.79,33.33 20.79,14.6 LED35.A
COL4  (via drill 0.6)
  Top 0.406: LED4.A 11.9,16.5 15.08,16.5 | 15.08,16.5 19.52,16.5 | 19.52,16.5 23.96,16.5 | 23.96,16.5 28.41,16.5 | 28.41,16.5 32.85,16.5 | 32.85,16.5 37.3,16.5 | 37.3,16.5 41.74,16.5 | 41.74,16.5 46.19,16.5 | 46.19,16.5 50.63,16.5 | 50.63,16.5 55.08,16.5 | 55.08,16.5 59.52,16.5 | 59.52,16.5 63.97,16.5 | 63.97,16.5 68.41,16.5 | 68.41,16.5 72.86,16.5 | 72.86,16.5 76.03,16.5 LED244.A | 72.86,16.5 LED228.A | 68.41,16.5 LED212.A | 63.97,16.5 LED196.A | 59.52,16.5 LED180.A | 55.08,16.5 LED164.A | 50.63,16.5 LED148.A | 46.19,16.5 LED132.A | 41.74,16.5 LED116.A | 37.3,16.5 LED100.A | 32.85,16.5 LED84.A | 28.41,16.5 LED68.A | 23.96,16.5 LED52.A | 19.52,16.5 LED36.A | 15.08,16.5 LED20.A | COL.13 7.46,29.84 10,32.38 v25.23,32.38
  Bottom 0.406: v25.23,32.38 25.23,19.05 LED52.A
COL5  (via drill 0.6)
  Top 0.406: LED5.A 11.9,20.95 15.08,20.95 | 19.52,20.95 15.08,20.95 | 23.96,20.95 19.52,20.95 | 28.41,20.95 23.96,20.95 | 28.41,20.95 32.85,20.95 | 32.85,20.95 37.3,20.95 | 37.3,20.95 41.74,20.95 | 41.74,20.95 46.19,20.95 | 46.19,20.95 50.63,20.95 | 50.63,20.95 55.08,20.95 | 55.08,20.95 59.52,20.95 | 59.52,20.95 63.97,20.95 | 63.97,20.95 68.41,20.95 | 68.41,20.95 72.86,20.95 | 72.86,20.95 76.03,20.95 LED245.A | 72.86,20.95 LED229.A | 68.41,20.95 LED213.A | 63.97,20.95 LED197.A | 59.52,20.95 LED181.A | 55.08,20.95 LED165.A | 50.63,20.95 LED149.A | 46.19,20.95 LED133.A | 41.74,20.95 LED117.A | 37.3,20.95 LED101.A | 32.85,20.95 LED85.A | LED69.A 28.41,20.95 | 23.96,20.95 LED53.A | 19.52,20.95 LED37.A | 15.08,20.95 LED21.A | COL.12 4.92,28.57 v29.68,28.57
  Bottom 0.406: v29.68,28.57 29.68,23.49 LED69.A
COL6
  Top 0.406: 15.08,25.39 11.9,25.39 LED6.A 10,27.3 COL.11 | 15.08,25.39 19.52,25.39 | 19.52,25.39 23.96,25.39 | 23.96,25.39 28.41,25.39 | 28.41,25.39 32.85,25.39 | 32.85,25.39 37.3,25.39 | 37.3,25.39 41.74,25.39 | 41.74,25.39 46.19,25.39 | 46.19,25.39 50.63,25.39 | 50.63,25.39 55.08,25.39 | 55.08,25.39 59.52,25.39 | 59.52,25.39 63.97,25.39 | 63.97,25.39 68.41,25.39 | 68.41,25.39 72.86,25.39 | 72.86,25.39 76.03,25.39 LED246.A | 72.86,25.39 LED230.A | 68.41,25.39 LED214.A | 63.97,25.39 LED198.A | 59.52,25.39 LED182.A | 55.08,25.39 LED166.A | 50.63,25.39 LED150.A | 46.19,25.39 LED134.A | 41.74,25.39 LED118.A | 37.3,25.39 LED102.A | 32.85,25.39 LED86.A | 28.41,25.39 LED70.A | 23.96,25.39 LED54.A | 19.52,25.39 LED38.A | 15.08,25.39 LED22.A
COL7  (via drill 0.6)
  Top 0.406: LED7.A 11.9,29.84 15.08,29.84 | 19.52,29.84 15.08,29.84 | 23.96,29.84 19.52,29.84 | 28.41,29.84 23.96,29.84 | 32.85,29.84 28.41,29.84 | 32.85,29.84 37.3,29.84 | 37.3,29.84 41.74,29.84 | 41.74,29.84 46.19,29.84 | 46.19,29.84 50.63,29.84 | 50.63,29.84 55.08,29.84 | 55.08,29.84 59.52,29.84 | 59.52,29.84 63.97,29.84 | 63.97,29.84 68.41,29.84 | 68.41,29.84 72.86,29.84 | 72.86,29.84 76.03,29.84 LED247.A | 72.86,29.84 LED231.A | 68.41,29.84 LED215.A | 63.97,29.84 LED199.A | 59.52,29.84 LED183.A | 55.08,29.84 LED167.A | 50.63,29.84 LED151.A | 46.19,29.84 LED135.A | 41.74,29.84 LED119.A | 37.3,29.84 LED103.A | LED87.A 32.85,29.84 | 28.41,29.84 LED71.A | 23.96,29.84 LED55.A | 19.52,29.84 LED39.A | 15.08,29.84 LED23.A | COL.10 4.92,26.03 8.09,26.03 9.68,24.44 v34.12,24.44
  Bottom 0.406: v34.12,24.44 34.12,29.84 LED87.A
COL8  (via drill 0.6)
  Top 0.406: LED8.A 11.9,34.29 15.08,34.29 | 19.52,34.29 15.08,34.29 | 23.96,34.29 19.52,34.29 | 28.41,34.29 23.96,34.29 | 32.85,34.29 28.41,34.29 | 37.3,34.29 32.85,34.29 | 37.3,34.29 41.74,34.29 | 41.74,34.29 46.19,34.29 | 46.19,34.29 50.63,34.29 | 50.63,34.29 55.08,34.29 | 55.08,34.29 59.52,34.29 | 59.52,34.29 63.97,34.29 | 63.97,34.29 68.41,34.29 | 68.41,34.29 72.86,34.29 | 72.86,34.29 76.03,34.29 LED248.A | 72.86,34.29 LED232.A | 68.41,34.29 LED216.A | 63.97,34.29 LED200.A | 59.52,34.29 LED184.A | 55.08,34.29 LED168.A | 50.63,34.29 LED152.A | 46.19,34.29 LED136.A | 41.74,34.29 LED120.A | 32.85,34.29 LED88.A | 28.41,34.29 LED72.A | 23.96,34.29 LED56.A | 19.52,34.29 LED40.A | 15.08,34.29 LED24.A | LED104.A 37.3,34.29 | COL.9 7.77,24.76 9.04,23.49 v38.57,23.49
  Bottom 0.406: v38.57,23.49 38.57,34.29 LED104.A
COL9  (via drill 0.6)
  Top 0.406: LED9.A 11.9,38.73 15.08,38.73 | 19.52,38.73 15.08,38.73 | 23.96,38.73 19.52,38.73 | 28.41,38.73 23.96,38.73 | 32.85,38.73 28.41,38.73 | 37.3,38.73 32.85,38.73 | 41.74,38.73 37.3,38.73 | 41.74,38.73 46.19,38.73 | 46.19,38.73 50.63,38.73 | 50.63,38.73 55.08,38.73 | 55.08,38.73 59.52,38.73 | 59.52,38.73 63.97,38.73 | 63.97,38.73 68.41,38.73 | 68.41,38.73 72.86,38.73 | 72.86,38.73 76.03,38.73 LED249.A | 72.86,38.73 LED233.A | 68.41,38.73 LED217.A | 63.97,38.73 LED201.A | 59.52,38.73 LED185.A | 55.08,38.73 LED169.A | 50.63,38.73 LED153.A | 46.19,38.73 LED137.A | LED121.A 41.74,38.73 | 37.3,38.73 LED105.A | 32.85,38.73 LED89.A | 28.41,38.73 LED73.A | 23.96,38.73 LED57.A | 19.52,38.73 LED41.A | 15.08,38.73 LED25.A | COL.8 4.92,23.49 7.46,23.49 10.95,20 v43.02,20
  Bottom 0.406: v43.02,20 43.02,38.73 LED121.A
COL10  (via drill 0.6)
  Top 0.406: LED10.A 11.58,43.17 15.08,43.17 | 19.52,43.17 15.08,43.17 | 23.96,43.17 19.52,43.17 | 28.41,43.17 23.96,43.17 | 32.85,43.17 28.41,43.17 | 37.3,43.17 32.85,43.17 | 41.74,43.17 37.3,43.17 | 46.19,43.17 41.74,43.17 | 46.19,43.17 50.63,43.17 | 50.63,43.17 55.08,43.17 | 55.08,43.17 59.52,43.17 | 59.52,43.17 63.97,43.17 | 63.97,43.17 68.41,43.17 | 68.41,43.17 72.86,43.17 | 72.86,43.17 76.03,43.17 LED250.A | 72.86,43.17 LED234.A | 68.41,43.17 LED218.A | 63.97,43.17 LED202.A | 59.52,43.17 LED186.A | 55.08,43.17 LED170.A | 50.63,43.17 LED154.A | LED138.A 46.19,43.17 | 41.74,43.17 LED122.A | 37.3,43.17 LED106.A | 32.85,43.17 LED90.A | 28.41,43.17 LED74.A | 23.96,43.17 LED58.A | 19.52,43.17 LED42.A | 15.08,43.17 LED26.A | COL.7 7.46,22.22 10.63,19.05 v47.46,19.05
  Bottom 0.406: v47.46,19.05 47.46,43.17 LED138.A
COL11  (via drill 0.6)
  Top 0.406: LED11.A 11.9,47.62 15.08,47.62 | 19.52,47.62 15.08,47.62 | 23.96,47.62 19.52,47.62 | 28.41,47.62 23.96,47.62 | 32.85,47.62 28.41,47.62 | 37.3,47.62 32.85,47.62 | 41.74,47.62 37.3,47.62 | 46.19,47.62 41.74,47.62 | 50.63,47.62 46.19,47.62 | 50.63,47.62 55.08,47.62 | 55.08,47.62 59.52,47.62 | 59.52,47.62 63.97,47.62 | 63.97,47.62 68.41,47.62 | 68.41,47.62 72.86,47.62 | 72.86,47.62 76.03,47.62 LED251.A | 72.86,47.62 LED235.A | 68.41,47.62 LED219.A | 63.97,47.62 LED203.A | 59.52,47.62 LED187.A | 55.08,47.62 LED171.A | LED155.A 50.63,47.62 | 46.19,47.62 LED139.A | 41.74,47.62 LED123.A | 37.3,47.62 LED107.A | 32.85,47.62 LED91.A | 28.41,47.62 LED75.A | 23.96,47.62 LED59.A | 19.52,47.62 LED43.A | 15.08,47.62 LED27.A | COL.6 4.92,20.95 7.46,20.95 9.36,19.05 9.36,17.14 10.95,15.55 v51.91,15.55
  Bottom 0.406: v51.91,15.55 51.91,47.62 LED155.A
COL12  (via drill 0.6)
  Top 0.406: LED12.A 11.9,52.06 15.08,52.06 | 19.52,52.06 15.08,52.06 | 23.96,52.06 19.52,52.06 | 28.41,52.06 23.96,52.06 | 32.85,52.06 28.41,52.06 | 37.3,52.06 32.85,52.06 | 41.74,52.06 37.3,52.06 | 46.19,52.06 41.74,52.06 | 50.63,52.06 46.19,52.06 | 55.08,52.06 50.63,52.06 | 55.08,52.06 59.52,52.06 | 59.52,52.06 63.97,52.06 | 63.97,52.06 68.41,52.06 | 68.41,52.06 72.86,52.06 | 72.86,52.06 76.03,52.06 LED252.A | 72.86,52.06 LED236.A | 68.41,52.06 LED220.A | 63.97,52.06 LED204.A | 59.52,52.06 LED188.A | LED172.A 55.08,52.06 | 50.63,52.06 LED156.A | 15.08,52.06 LED28.A | 19.52,52.06 LED44.A | 23.96,52.06 LED60.A | 28.41,52.06 LED76.A | 32.85,52.06 LED92.A | 37.3,52.06 LED108.A | 41.74,52.06 LED124.A | 46.19,52.06 LED140.A | COL.5 7.46,19.68 8.41,18.73 8.41,16.82 10.63,14.6 v56.35,14.6
  Bottom 0.406: v56.35,14.6 56.35,52.06 LED172.A
COL13  (via drill 0.6)
  Top 0.406: LED13.A 11.9,56.51 15.08,56.51 | 19.52,56.51 15.08,56.51 | 23.96,56.51 19.52,56.51 | 28.41,56.51 23.96,56.51 | 32.85,56.51 28.41,56.51 | 37.3,56.51 32.85,56.51 | 41.74,56.51 37.3,56.51 | 46.19,56.51 41.74,56.51 | 50.63,56.51 46.19,56.51 | 55.08,56.51 50.63,56.51 | 59.52,56.51 55.08,56.51 | 59.52,56.51 63.97,56.51 | 63.97,56.51 68.41,56.51 | 68.41,56.51 72.86,56.51 | 72.86,56.51 76.03,56.51 LED253.A | 72.86,56.51 LED237.A | 68.41,56.51 LED221.A | 63.97,56.51 LED205.A | LED189.A 59.52,56.51 | 55.08,56.51 LED173.A | 50.63,56.51 LED157.A | 46.19,56.51 LED141.A | 41.74,56.51 LED125.A | 37.3,56.51 LED109.A | 32.85,56.51 LED93.A | 28.41,56.51 LED77.A | 19.52,56.51 LED45.A | 15.08,56.51 LED29.A | 23.96,56.51 LED61.A | COL.4 4.92,18.41 6.82,18.41 7.46,17.78 7.46,16.5 9.04,14.92 9.04,13.01 10.95,11.11 v60.8,11.11
  Bottom 0.406: v60.8,11.11 60.8,56.51 LED189.A
COL14  (via drill 0.6)
  Top 0.406: LED14.A 11.9,60.95 15.08,60.95 | 19.52,60.95 15.08,60.95 | 23.96,60.95 19.52,60.95 | 28.41,60.95 23.96,60.95 | 32.85,60.95 28.41,60.95 | 37.3,60.95 32.85,60.95 | 41.74,60.95 37.3,60.95 | 46.19,60.95 41.74,60.95 | 50.63,60.95 46.19,60.95 | 55.08,60.95 50.63,60.95 | 59.52,60.95 55.08,60.95 | 63.97,60.95 59.52,60.95 | 63.97,60.95 68.41,60.95 | 68.41,60.95 72.86,60.95 | 72.86,60.95 76.03,60.95 LED254.A | LED206.A 63.97,60.95 | 68.41,60.95 LED222.A | 72.86,60.95 LED238.A | 59.52,60.95 LED190.A | 55.08,60.95 LED174.A | 50.63,60.95 LED158.A | 46.19,60.95 LED142.A | 41.74,60.95 LED126.A | 37.3,60.95 LED110.A | 32.85,60.95 LED94.A | 28.41,60.95 LED78.A | 23.96,60.95 LED62.A | 19.52,60.95 LED46.A | 15.08,60.95 LED30.A | COL.3 6.18,16.5 8.09,14.6 8.09,12.38 10.31,10.16 v65.24,10.16
  Bottom 0.406: v65.24,10.16 65.24,60.95 LED206.A
COL15  (via drill 0.6)
  Top 0.406: LED15.A 11.9,65.4 15.08,65.4 | 19.52,65.4 15.08,65.4 | 23.96,65.4 19.52,65.4 | 28.41,65.4 23.96,65.4 | 32.85,65.4 28.41,65.4 | 37.3,65.4 32.85,65.4 | 41.74,65.4 37.3,65.4 | 46.19,65.4 41.74,65.4 | 50.63,65.4 46.19,65.4 | 55.08,65.4 50.63,65.4 | 59.52,65.4 55.08,65.4 | 63.97,65.4 59.52,65.4 | 68.41,65.4 63.97,65.4 | 72.86,65.4 68.41,65.4 | 72.86,65.4 76.03,65.4 LED255.A | LED239.A 72.86,65.4 | 68.41,65.4 LED223.A | 63.97,65.4 LED207.A | 59.52,65.4 LED191.A | 55.08,65.4 LED175.A | 50.63,65.4 LED159.A | 46.19,65.4 LED143.A | 41.74,65.4 LED127.A | 37.3,65.4 LED111.A | 32.85,65.4 LED95.A | 28.41,65.4 LED79.A | 23.96,65.4 LED63.A | 19.52,65.4 LED47.A | 15.08,65.4 LED31.A | COL.2 3.64,12.7 10.63,5.71 v74.13,5.71
  Bottom 0.406: v74.13,5.71 74.13,65.4 LED239.A
COL16  (via drill 0.6)
  Top 0.406: LED16.A 11.9,69.84 15.08,69.84 | 19.52,69.84 15.08,69.84 | 23.96,69.84 19.52,69.84 | 28.41,69.84 23.96,69.84 | 32.85,69.84 28.41,69.84 | 37.3,69.84 32.85,69.84 | 41.74,69.84 37.3,69.84 | 46.19,69.84 41.74,69.84 | 50.63,69.84 46.19,69.84 | 55.08,69.84 50.63,69.84 | 59.52,69.84 55.08,69.84 | 63.97,69.84 59.52,69.84 | 68.41,69.84 63.97,69.84 | 68.41,69.84 72.86,69.84 | 72.86,69.84 76.35,69.84 LED256.A | 72.86,69.84 LED240.A | LED224.A 68.41,69.84 | 63.97,69.84 LED208.A | 59.52,69.84 LED192.A | 55.08,69.84 LED176.A | 50.63,69.84 LED160.A | 46.19,69.84 LED144.A | 41.74,69.84 LED128.A | 37.3,69.84 LED112.A | 32.85,69.84 LED96.A | 28.41,69.84 LED80.A | 23.96,69.84 LED64.A | 19.52,69.84 LED48.A | 15.08,69.84 LED32.A | COL.1 6.18,11.43 10.95,6.66 v69.69,6.66
  Bottom 0.406: v69.69,6.66 69.69,69.84 LED224.A
ROW1
  Top 0.406: ROW.1 10.63,42.54 LED9.K
  Bottom 0.406: LED1.K LED2.K LED3.K LED4.K LED5.K LED6.K LED7.K LED8.K LED9.K LED10.K LED11.K LED12.K LED13.K LED14.K LED15.K LED16.K
ROW2
  Top 0.406: ROW.2 4.92,43.81 6.5,43.81 8.41,45.72 16.34,45.72 LED26.K
  Bottom 0.406: LED32.K LED31.K LED30.K LED29.K LED28.K LED27.K LED26.K LED25.K LED24.K LED23.K LED22.K LED21.K LED20.K LED19.K LED18.K LED17.K
ROW3
  Top 0.406: ROW.3 7.46,46.35 20.15,46.35 LED42.K
  Bottom 0.406: LED33.K LED34.K LED35.K LED36.K LED37.K LED38.K LED39.K LED40.K LED41.K LED42.K LED43.K LED44.K LED45.K LED46.K LED47.K LED48.K
ROW4
  Top 0.406: ROW.4 4.92,46.35 6.5,46.35 7.14,46.98 23.96,46.98 LED58.K
  Bottom 0.406: LED64.K LED63.K LED62.K LED61.K LED60.K LED59.K LED58.K | LED58.K LED57.K LED56.K LED55.K LED54.K LED53.K LED52.K LED51.K LED50.K LED49.K | LED58.K 26.5,46.03
ROW5
  Top 0.406: ROW.5 8.73,50.16 29.68,50.16 LED75.K
  Bottom 0.406: LED65.K LED66.K LED67.K LED68.K LED69.K LED70.K LED71.K LED72.K LED73.K LED74.K LED75.K LED76.K LED77.K LED78.K LED79.K LED80.K
ROW6
  Top 0.406: ROW.6 4.92,48.89 6.5,48.89 8.41,50.8 33.49,50.8 LED91.K
  Bottom 0.406: LED96.K LED95.K LED94.K LED93.K LED92.K LED91.K LED90.K LED89.K LED88.K LED87.K LED86.K LED85.K LED84.K LED83.K LED82.K LED81.K
ROW7
  Top 0.406: ROW.7 7.46,51.43 37.3,51.43 LED107.K
  Bottom 0.406: LED97.K LED98.K LED99.K LED100.K LED101.K LED102.K LED103.K LED104.K LED105.K LED106.K LED107.K | LED107.K 39.84,54.29 | LED107.K LED108.K LED109.K LED110.K LED111.K LED112.K
ROW8
  Top 0.406: ROW.8 4.6,51.43 6.5,51.43 9.68,54.61 43.02,54.61 LED124.K
  Bottom 0.406: LED128.K LED127.K LED126.K LED125.K LED124.K LED123.K | LED123.K LED122.K LED121.K LED120.K LED119.K LED118.K LED117.K LED116.K LED115.K LED114.K LED113.K | LED123.K 44.28,50.8
ROW9
  Top 0.406: ROW.9 8.73,55.24 46.82,55.24 LED140.K
  Bottom 0.406: LED129.K LED130.K LED131.K LED132.K LED133.K LED134.K LED135.K LED136.K LED137.K LED138.K LED139.K LED140.K | 48.73,54.92 LED140.K | LED140.K LED141.K LED142.K LED143.K LED144.K
ROW10
  Top 0.406: ROW.10 4.92,53.97 6.5,53.97 8.41,55.88 50.63,55.88 LED156.K
  Bottom 0.406: LED160.K LED159.K LED158.K LED157.K LED156.K | LED156.K LED155.K LED154.K LED153.K LED152.K LED151.K LED150.K LED149.K LED148.K LED147.K LED146.K LED145.K | LED156.K 53.17,55.56
ROW11
  Top 0.406: ROW.11 10,59.05 56.35,59.05 LED173.K
  Bottom 0.406: LED161.K LED162.K LED163.K LED164.K LED165.K LED166.K LED167.K LED168.K LED169.K LED170.K LED171.K LED172.K LED173.K | LED173.K 57.62,58.73 | LED173.K LED174.K LED175.K LED176.K
ROW12
  Top 0.406: ROW.12 4.92,56.51 6.5,56.51 9.68,59.69 60.16,59.69 LED189.K
  Bottom 0.406: LED192.K LED191.K LED190.K LED189.K | LED189.K LED188.K LED187.K LED186.K LED185.K LED184.K LED183.K LED182.K LED181.K LED180.K LED179.K LED178.K LED177.K | LED189.K 62.06,59.37
ROW13
  Top 0.406: ROW.13 8.73,60.32 63.97,60.32 LED205.K
  Bottom 0.406: LED193.K LED194.K LED195.K LED196.K LED197.K LED198.K LED199.K LED200.K LED201.K LED202.K LED203.K LED204.K LED205.K LED206.K LED207.K LED208.K
ROW14
  Top 0.406: ROW.14 4.92,59.05 6.5,59.05 7.46,60 7.46,62.54 8.41,63.49 69.69,63.49 LED222.K
  Bottom 0.406: LED224.K LED223.K LED222.K LED221.K LED220.K LED219.K LED218.K LED217.K LED216.K LED215.K LED214.K LED213.K LED212.K LED211.K LED210.K LED209.K
ROW15
  Top 0.406: ROW.15 6.18,62.54 7.77,64.13 73.5,64.13 LED238.K
  Bottom 0.406: LED225.K LED226.K LED227.K LED228.K LED229.K LED230.K LED231.K LED232.K LED233.K LED234.K LED235.K LED236.K LED237.K LED238.K LED239.K LED240.K
ROW16
  Top 0.406: ROW.16 3.64,61.27 7.14,64.77 77.3,64.77 LED254.K
  Bottom 0.406: LED256.K LED255.K LED254.K LED253.K LED252.K LED251.K LED250.K LED249.K LED248.K LED247.K LED246.K LED245.K LED244.K LED243.K LED242.K LED241.K

### Text on the board
Bottom: Cols | Rows